# EAGLE design LineOut (EAGLE 7.7.0)
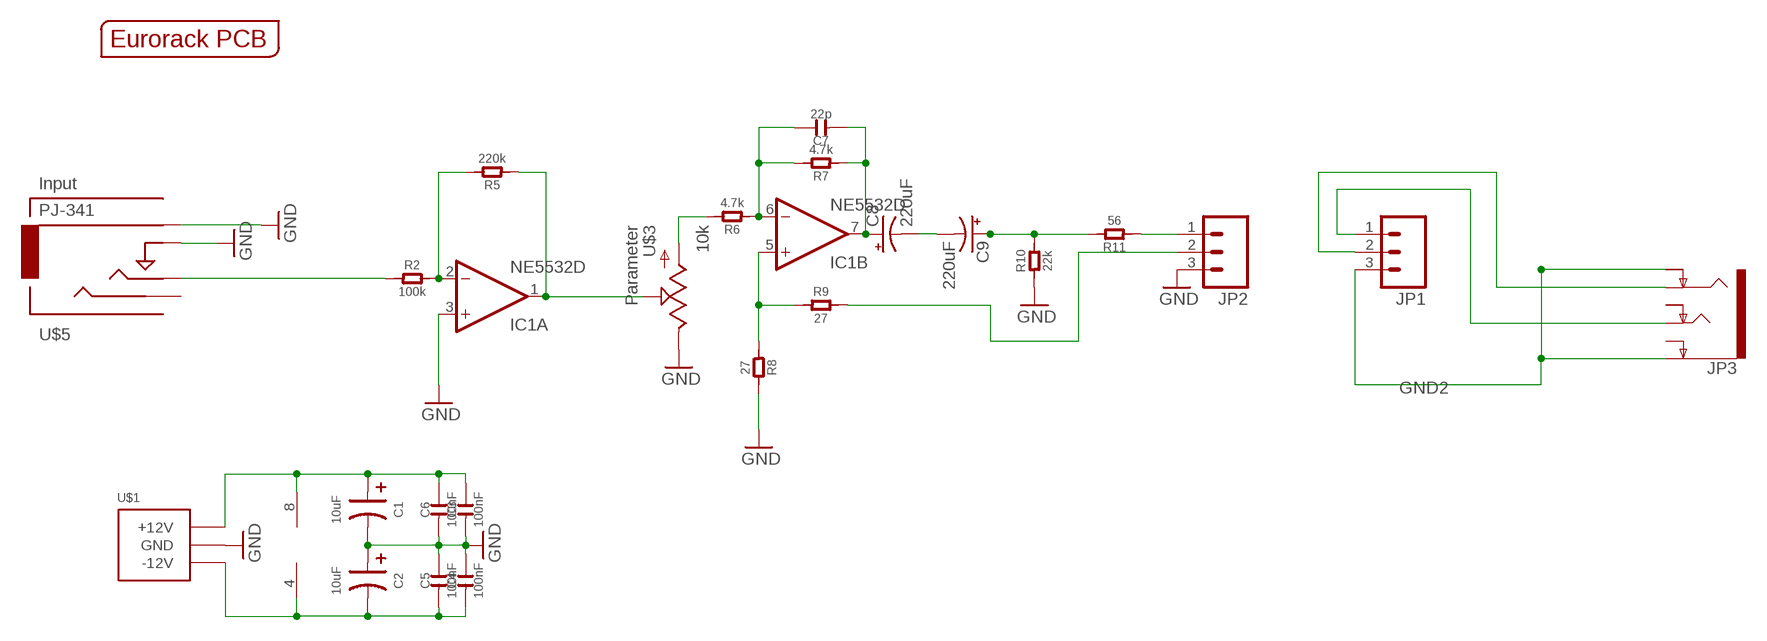
[diagram p0: schematic, sheet 1]

## Parts
C1  10uF  C-POLAR-A  [AVX-A]
C2  10uF  C-POLAR-A  [AVX-A]
C3  100nF  C-0603  [C0603]
C4  100nF  C-0603  [C0603]
C5  100nF  C-0603  [C0603]
C6  100nF  C-0603  [C0603]
C7  22p  C-0603  [C0603]
C8  220uF  CPOL-US153CLV-0505  [153CLV-0505]
C9  220uF  CPOL-US153CLV-0505  [153CLV-0505]
IC1  NE5532D  [SO08]
JP1  M03PTH  [1X03]
JP2  M03PTH  [1X03]
JP3  AUDIO-JACK4-.25-HORIZ-TRS  [AUDIO-JACK-.25-INCH-HORIZ-PTH]
R2  100k  R-0603  [R0603]
R5  220k  R-0603  [R0603]
R6  4.7k  R-0603  [R0603]
R7  4.7k  R-0603  [R0603]
R8  27  R-0603  [R0603]
R9  27  R-0603  [R0603]
R10  22k  R-0603  [R0603]
R11  56  R-0603  [R0603]
U$1  POWER_SIMPLE10  [POWER_10]
U$3  10k  POTZEPHPOT  [OG-POTS_ALPS_POT_VERTICAL]
U$5  PJ-341  AUDIO-JACKINPUT  [3.5MM-JACK-SWITCH-13MM-INPUT]
U$6  EURORACK_PCB4HP  [EURORACK4HPPCB]

## Nets
+12V: C1.+ C3.2 C6.2 IC1.8(P:V+) U$1.9(+12V) U$1.10(+12V)
-12V: C2.- C4.1 C5.1 IC1.4(P:V-) U$1.1(-12V) U$1.2(-12V)
GND: C1.- C2.+ C3.1 C4.2 C5.2 C6.1 IC1.3(A:+IN) JP2.3 R8.2 R10.1 U$1.3(GND) U$1.4(GND) U$1.5(GND) U$1.6(GND) U$1.7(GND) U$1.8(GND) U$3.P$1(E) U$5.RING@3(RING) U$5.SWITCH@3(SWITCH)
GND2: JP1.3 JP3.P$2(EARTH) JP3.P$5(RING-NORM)
N$1: JP2.1 R11.1
N$2: JP1.1 JP3.P$6(TIP)
N$3: C9.+ R10.2 R11.2
N$4: C7.1 C8.+ IC1.7(B:OUT) R7.1
N$5: IC1.5(B:+IN) R8.1 R9.1
N$6: JP2.2 R9.2
N$7: C7.2 IC1.6(B:-IN) R6.1 R7.2
N$8: IC1.2(A:-IN) R2.2 R5.2
N$9: IC1.1(A:OUT) R5.1 U$3.P$2(S)
N$12: R6.2 U$3.P$3(A)
N$13: C8.- C9.-
N$14: R2.1 U$5.TIP@3(TIP)
N$18: JP1.2 JP3.P$4(RING)
Unconnected: JP3.P$3(EARTH-NORM) JP3.P$7(TIP-NORM) U$5.SECOND@3(SECOND)

## Library data of the parts
C1 C2 = EurorackModularParts:C-POLAR*
C3-C7 = OPL:C*
C8 C9 = adafruit:CPOL-US: POLARIZED CAPACITOR, American symbol
IC1 = EurorackModularParts:NE5532: AUDIO AMPLIFIER
JP1 JP2 = SparkFun-Connectors:M03: Header 3 Standard 3-pin 0.1" header. Use with straight break away headers (SKU : PRT-00116), right angle break away headers (PRT-00553), swiss pins (PRT-00743), machine pins (PRT-00117), and female headers (PRT-00115). Molex polarized connector foot print use with SKU : PRT-08232 with associated crimp pins and housings.
JP3 = EurorackModularParts:AUDIO-JACK4-.25-HORIZ-TRS: 1/4" TRS jack, horizontal Production SKU: COM-11144 Footprint unproven - datasheet and part seem to be slightly different; PROD_ID: COM-11144
R2 R5-R11 = OPL:R*
U$1 = EurorackModularParts:POWER_SIMPLE
U$3 = EurorackModularParts:POT; DESC: Parameter
U$5 = EurorackModularParts:AUDIO-JACK: Switching Mono 3.5mm Audio Jack from Erthenvar.; DESC: Input; MPN: PJ-341
U$6 = EurorackModularParts:EURORACK_PCB

## Board
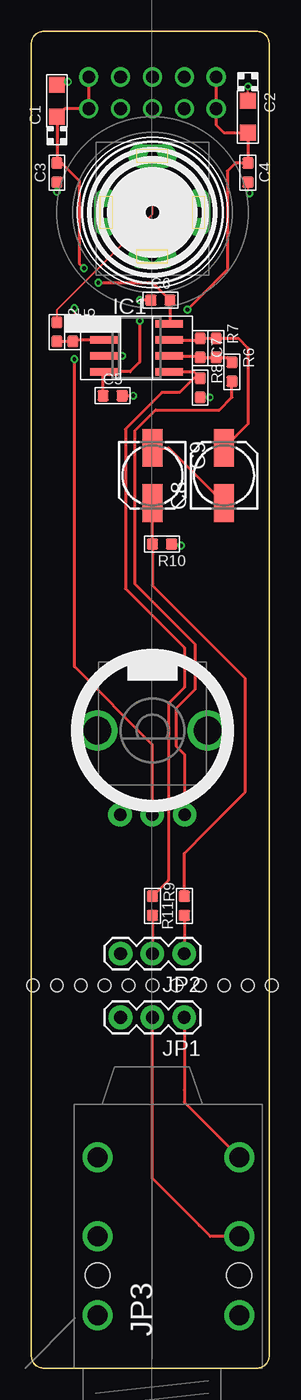
[diagram p1: board, top side]
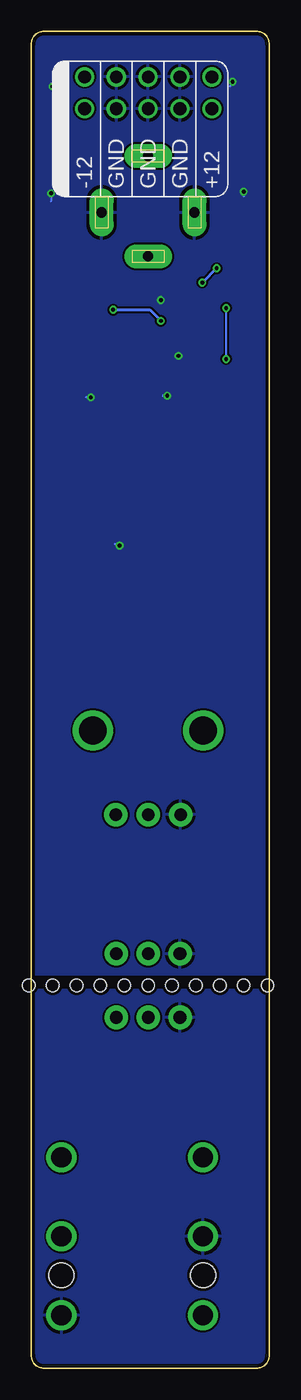
[diagram p2: board, bottom side, seen from below]

Size 18.98 x 106.5 mm. Coordinates in mm from the lower left corner, seen from the top.
Copper layers (1*16): Top 0.035mm / dielectric 1.5mm / Bottom 0.035mm
Design rules "ITEADstudio_DRC": minimum track width 6mil, minimum drill 12mil, track to track 6mil, track to pad 6mil, pad to pad 6mil, via to via 6mil, smd to smd 0mil, copper to edge 10mil, drill to drill 10mil, minimum pad ring 10mil, minimum via ring 6mil, stop-mask expansion 2mil, vias tented up to drill 100mil, thermal gap 10mil
Holes 1 mm at 9.66,30.48 7.76,30.48 5.85,30.48 3.95,30.48 2.04,30.48 0.14,30.48 11.56,30.48 13.47,30.48 15.38,30.48 17.28,30.48 19.18,30.48

### Footprints (pad centres in the part's own frame; a part is rotated, then mirrored left to right if it is on the bottom)
AVX-A = smd 1.27 x 1.27: + -1.27,0; - 1.27,0
C0603 = smd 0.889 x 0.889: 1 -0.762,0; 2 0.762,0
153CLV-0505 = smd 3 x 1.6: + 2.2,0; - -2.2,0
SO08 = smd 0.6 x 2.2: 1 -1.905,-2.6; 2 -0.635,-2.6; 3 0.635,-2.6; 4 1.905,-2.6; 5 1.905,2.6; 6 0.635,2.6; 7 -0.635,2.6; 8 -1.905,2.6
1X03 = drill 1.016 pad 1.88: 1 0,0; 2 2.54,0; 3 5.08,0
AUDIO-JACK-.25-INCH-HORIZ-PTH = drill 1.6: P$2 4.2,-6.92; P$3 4.2,4.38; P$4 10.5,-6.92; P$5 10.5,4.38; P$6 16.8,-6.92; P$7 16.8,4.38 | hole 2: 7.4,4.38; 7.4,-6.92
R0603 = smd 0.889 x 0.889: 1 -0.762,0; 2 0.762,0
POWER_10 = drill 1.016: 1 -5.08,-1.27; 2 -5.08,1.27; 3 -2.54,-1.27; 4 -2.54,1.27; 5 0,-1.27; 6 0,1.27; 7 2.54,-1.27; 8 2.54,1.27; 9 5.08,-1.27; 10 5.08,1.27
OG-POTS_ALPS_POT_VERTICAL = drill 1 pad 1.88: P$1 -2.58,-6.7; P$2 0,-6.7; P$3 2.58,-6.7 | drill 2.2 pad 3.175: P$4 4.4,0; P$5 -4.4,0
3.5MM-JACK-SWITCH-13MM-INPUT = drill 0.8 pad 1.93 long: RING@3 -3.7,0; SECOND@3 0,-3.5; SWITCH@3 3.7,0; TIP@3 0,4.5

### Placement (x,y rotation side)
C1  2.04,100.97 90 top
C2  17.28,99.69 270 top
C3  2.04,95.25 90 top
C4  17.28,95.25 270 top
C5  6.49,77.47 0 top
C6  10.29,85.09 0 top
C7  13.47,81.28 270 top
C8  15.38,71.12 90 top
C9  9.66,71.12 270 top
IC1  8.39,81.28 270 top
JP1  12.2,27.94 180 top
JP2  12.2,33.02 180 top
JP3  9.66,0 90 top
R2  2.04,82.55 270 top
R5  3.31,82.55 270 top
R6  16.01,79.38 270 top
R7  14.74,81.28 270 top
R8  13.47,78.11 270 top
R9  9.66,36.83 270 top
R10  10.42,65.66 180 top
R11  12.2,36.83 90 top
U$1  9.66,101.6 0 bottom
U$3  9.66,50.8 0 top
U$5  9.66,92.08 0 top
U$6  -0.5,0 0 top

### Tracks (layer width: path | path; a pad name or v marks a point on that pad's centre or on a via)
+12V  (via drill 0.3)
  Top 0.254: U$1.10 U$1.9 2.67,100.33 C1.+ C3.2 2.42,96.01 3.82,94.61 3.82,88.01 v4.2,87.63 | v5.34,86.49 9.66,86.49 C6.2 11.06,83.25 IC1.8
  Bottom 0.254: v4.2,87.63 v5.34,86.49
-12V  (via drill 0.3)
  Top 0.254: U$1.2 U$1.1 14.74,99.06 15.38,98.42 C2.- C4.1 16.26,96.01 15.63,95.38 15.63,87.5 v12.45,84.33 | C5.1 5.72,79.31 IC1.4 7.88,79.38 8.64,80.14 v8.64,83.44
  Bottom 0.254: v12.45,84.33 9.53,84.33 v8.64,83.44
GND  (via drill 0.3)
  Top 0.152: C3.1 v2.04,93.73 | C1.- 2.67,102.23 v2.93,102.49 | C2.+ v17.28,102.11 | C4.2 17.28,93.73 v17.41,93.6 | IC1.3 v7.25,80.64 | R10.1 11.82,65.66 v11.95,65.53
  Top 0.254: C6.1 v8.64,85.09 | C5.2 v8.14,77.47 | R8.2 v14.23,77.34
  Bottom 0.152: v2.04,93.73 2.04,93.34 | v2.93,102.49 2.93,102.36 3.18,102.11 | v17.28,102.11 17.28,102.23 17.41,102.36 | v17.41,93.6 17.41,92.96 | v8.64,85.09 8.39,85.09 | v7.25,80.64 7.5,80.64 | v8.14,77.47 8.52,77.47 | v14.23,77.34 14.61,77.34 | v11.95,65.53 12.2,65.53 12.33,65.66
  pour Bottom: -1.01,106.93 -1.01,31.37 20.96,31.37 20.96,106.93
GND2
  pour Bottom: -1.01,30.1 21.34,30.1 21.34,-0.89 -1.52,-0.89 -1.52,30.1
N$1
  Top 0.254: R11.1 JP2.1
N$2
  Top 0.254: JP1.1 12.2,22.14 12.2,21.18 JP3.P$6
N$3
  Top 0.254: R11.2 12.2,41.02 14.04,42.86 | 14.04,42.86 14.36,43.18 | C9.+ R10.2 9.66,62.36 17.03,54.99 17.03,45.85 14.04,42.86
N$4
  Top 0.254: IC1.7 13.34,81.92 C7.1 R7.1 16.52,82.04 17.28,81.28 17.28,75.22 C8.+
N$5
  Top 0.254: IC1.5 12.96,79.38 R8.1 12.96,78.87 11.82,77.72 10.42,77.72 7.5,74.8 7.5,62.1 12.2,57.4 12.2,54.23 10.93,52.96 10.93,38.86 R9.1
N$6
  Top 0.254: R9.2 JP2.2
N$7
  Top 0.254: IC1.6 13.34,80.64 C7.2 R7.2 15.63,80.52 R6.1
N$8
  Top 0.254: IC1.2 3.44,81.92 R5.2 R2.2
N$9  (via drill 0.3)
  Top 0.152: v3.44,84.45 3.44,83.44
  Top 0.254: IC1.1 3.44,83.19 R5.1 3.44,83.44 | U$3.P$2 9.66,49.66 3.44,55.88 v3.44,80.39
  Bottom 0.152: v3.44,80.39 v3.44,84.45
N$12
  Top 0.254: U$3.P$3 12.24,48.85 11.56,49.53 11.56,52.58 13.09,54.1 13.09,57.66 8.26,62.48 8.26,74.68 9.91,76.33 14.99,76.33 16.01,77.34 R6.2
N$13
  Top 0.254: C9.- 10.97,73.32 C8.-
N$14
  Top 0.152: R2.1 2.04,84.33 9.66,91.95 U$5.TIP@3
N$18
  Top 0.254: 13.67,11.1 13.41,11.37 | 13.41,11.37 9.66,15.11 JP1.2 | JP3.P$4 14.27,10.5 13.41,11.37